# Altium project 04_3_fulladder4.PrjPcb
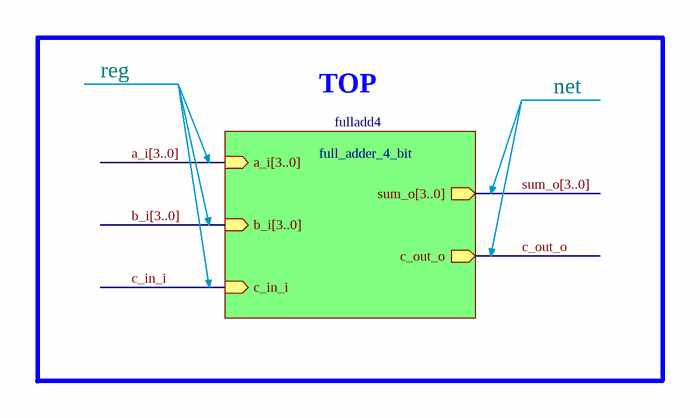
[diagram p0: fulladd4_tb.SchDoc]
2 sheets, 1 parts. Net scope: hierarchical (ports join the sheet entries above them; power ports are global).
Sheets:
  fulladd4_tb.SchDoc
    fulladd4 = full_adder_4_bit.SchDoc

## Sheet fulladd4_tb.SchDoc
size 111 x 66 mm

### Sub-sheets
fulladd4 = full_adder_4_bit.SchDoc: a_i[3..0] (in), b_i[3..0] (in), c_in_i (in), sum_o[3..0] (out), c_out_o (out)  | ComponentName: full_adder_4_bit

### Buses and harness runs
bus a_i[3..0] = sheet fulladd4/a_i[3..0]
bus b_i[3..0] = sheet fulladd4/b_i[3..0]
bus sum_o[3..0] = sheet fulladd4/sum_o[3..0]

### Notes on the sheet
- reg
- TOP
- net

## Sheet full_adder_4_bit.SchDoc
size 111 x 66 mm
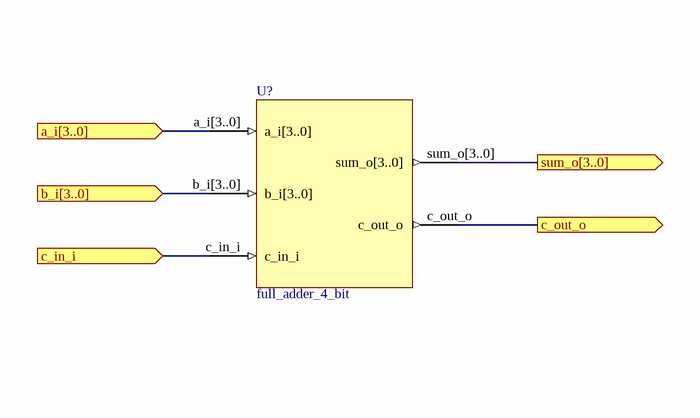
[diagram p1: full_adder_4_bit.SchDoc]

### Parts
U?  full_adder_4_bit

### Ports
a_i[3..0] (in), b_i[3..0] (in), c_in_i (in), c_out_o (out), sum_o[3..0] (out)

### Nets
a_i[3..0]: U?.a_i[3..0] ; port a_i[3..0]
b_i[3..0]: U?.b_i[3..0] ; port b_i[3..0]
c_in_i: U?.c_in_i ; port c_in_i
c_out_o: U?.c_out_o ; port c_out_o
sum_o[3..0]: U?.sum_o[3..0] ; port sum_o[3..0]